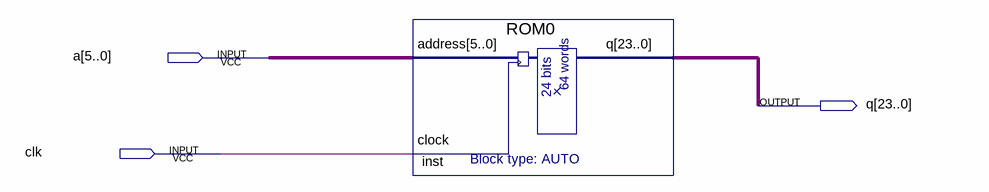
[diagram p0: schematic sheet]
// Quartus schematic exp2_1.bdf as structural Verilog: 1 symbols, 3 pins
module exp2_1 (
  input  [5:0] a,
  input  clk,
  output [23:0] q
);

  ROM0 inst (.address(a), .clock(clk), .q(q));
endmodule
